# Altium schematic sheet sheet.SchDoc
size A3
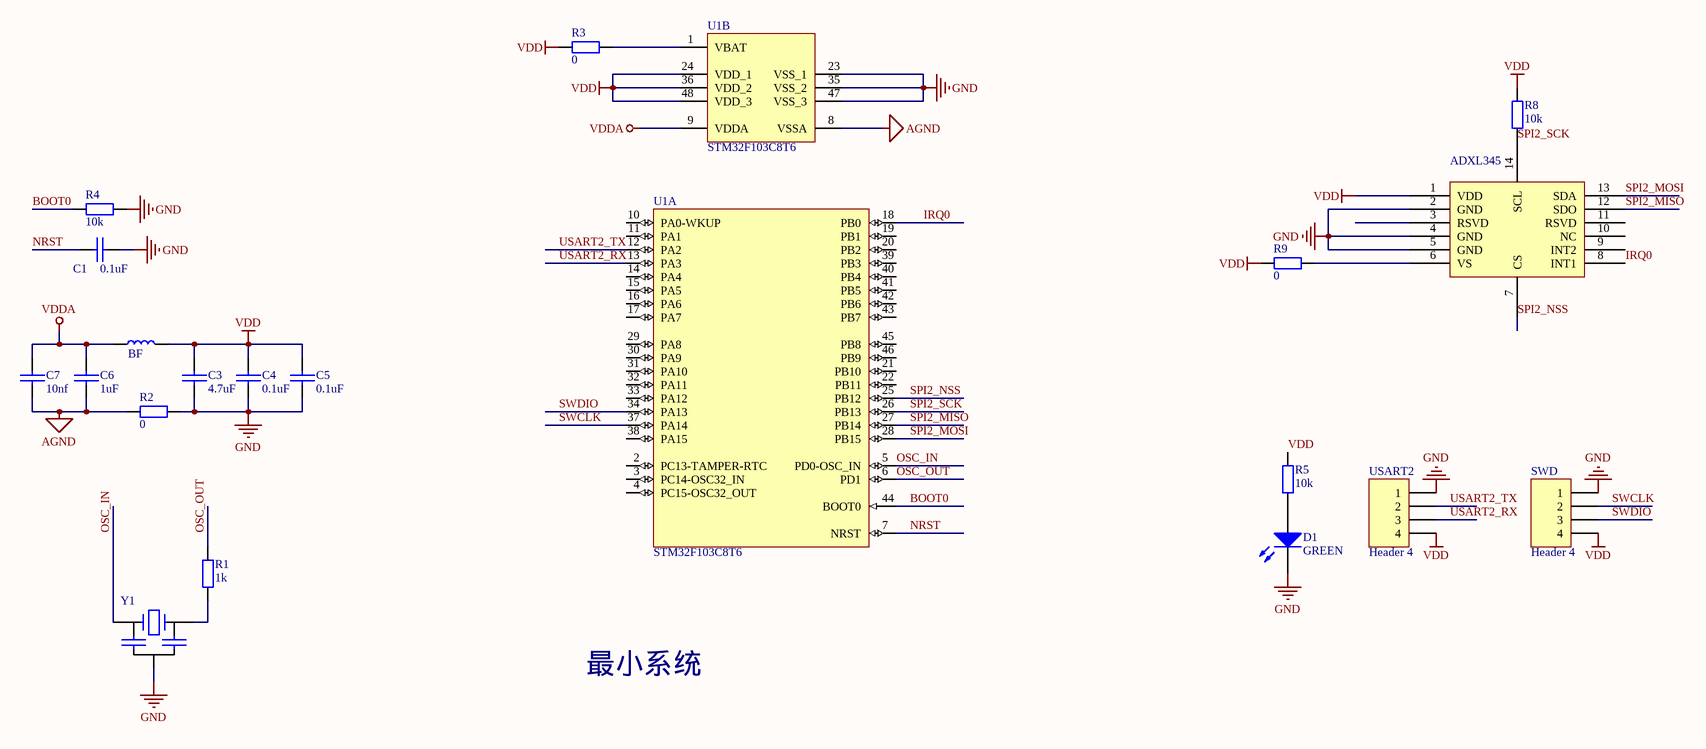
[diagram p0: sheet.SchDoc]

## Parts
ADXL345  ADXL345  [ADXL345]  (value not drawn)
BF  BF  [R1608[0603]]  (value not drawn)
C1  value 0.1uF  [C1608[0603]N]  (hidden comment: cap smd)
C3  value 4.7uF  [C1608[0603]N]  (hidden comment: cap smd)
C4  value 0.1uF  [C1608[0603]N]  (hidden comment: cap smd)
C5  value 0.1uF  [C1608[0603]N]  (hidden comment: cap smd)
C6  value 1uF  [C1608[0603]N]  (hidden comment: cap smd)
C7  value 10nf  [C1608[0603]N]  (hidden comment: cap smd)
D1  value GREEN  [D1608[0603]]  (hidden comment: LED)
R1  value 1k  [R1608[0603]]  (hidden comment: RES1)
R2  value 0  [R1608[0603]]  (hidden comment: RES1)
R3  value 0  [1608[0603]]  (hidden comment: RES1)
R4  value 10k  [R1608[0603]]  (hidden comment: RES1)
R5  value 10k  [R1608[0603]]  (hidden comment: RES1)
R8  value 10k  [R1608[0603]]  (hidden comment: RES1)
R9  value 0  [R1608[0603]]  (hidden comment: RES1)
SWD  Header 4  [HDR1X4]
U1  STM32F103C8T6  [LQFP48_N]  (parts A,B of 2)
USART2  Header 4  [HDR1X4]
Y1  CSTCE8M00G52  [Crystal_C]  (value not drawn)

## Nets
AGND: C6.2 C7.2 R2.1 U1.8(VSSA)
GND: ADXL345.2(GND) ADXL345.4(GND) ADXL345.5(GND) C1.1 C3.2 C4.2 C5.2 D1.2(K) R2.2 R4.1 SWD.1 U1.23(VSS_1) U1.35(VSS_2) U1.47(VSS_3) USART2.1 Y1.2(GND)
VDD: ADXL345.1(VDD) BF.2 C3.1 C4.1 C5.1 R3.1 R5.2 R8.2 R9.1 SWD.4 U1.24(VDD_1) U1.36(VDD_2) U1.48(VDD_3) USART2.4
VDDA: BF.1 C6.1 C7.1 U1.9(VDDA)
BOOT0: R4.2 U1.44(BOOT0)
IRQ0: ADXL345.8(INT1) U1.18(PB0)
NRST: C1.2 U1.7(NRST)
OSC_IN: U1.5(PD0-OSC_IN) Y1.1
OSC_OUT: R1.2 U1.6(PD1)
SPI2_MISO: ADXL345.12(SDO) U1.27(PB14)
SPI2_MOSI: ADXL345.13(SDA) U1.28(PB15)
SPI2_NSS: ADXL345.7(CS) U1.25(PB12)
SPI2_SCK: ADXL345.14(SCL) R8.1 U1.26(PB13)
SWCLK: SWD.2 U1.37(PA14)
SWDIO: SWD.3 U1.34(PA13)
USART2_RX: U1.13(PA3) USART2.3
USART2_TX: U1.12(PA2) USART2.2
NetADXL345_6: ADXL345.6(VS) R9.2
NetD1_1: D1.1(A) R5.1
NetR1_1: R1.1 Y1.3
NetR3_2: R3.2 U1.1(VBAT)

Not connected (* = marked no-connect by the designer): ADXL345 3(RSVD) 9(INT2) 10(NC) 11(RSVD); U1 2(PC13-TAMPER-RTC) 3(PC14-OSC32_IN) 4(PC15-OSC32_OUT) 10(PA0-WKUP) 11(PA1) 14(PA4) 15(PA5) 16(PA6) 17(PA7) 19(PB1) 20(PB2) 21(PB10) 22(PB11) 29(PA8) 30(PA9) 31(PA10) 32(PA11) 33(PA12) 38(PA15) 39(PB3) 40(PB4) 41(PB5) 42(PB6) 43(PB7) 45(PB8) 46(PB9)

## Notes on the sheet
- 最小系统

## Library data of the parts
BF = BF: 磁珠
C1 C3-C7 = CAP: 贴片无极性电容
D1 = LED: 蓝色 LED; Published: 8-Jun-2000; LatestRevisionDate: 08-Jul-2005; LatestRevisionNote: Mech Layer 1 removed.; Publisher: Altium Limited
SWD USART2 = Header 4: Header, 4-Pin; LatestRevisionDate: 17-Jul-2002; LatestRevisionNote: Re-released for DXP Platform.; Publisher: Altium Limited
U1 = STM32F103C8T6: STM32 ARM-based 32-bit MCU Performance Line with 64 kB Flash, 20 kB Internal RAM, -40 to +85癈 Temperature, 48-Pin LQFP, Tray; DatasheetVersion: rev13.0, Apr-2011; PackageVersion: rev13, Apr-2011; PackageReference: LQFP48; PackageDescription: 48-Pin Low-Profile Quad Flat Pack, 7 x 7 mm Body, 0.5 mm Pitch (LQFP48); ComponentLink1Description: Manufacturer URL; ComponentLink1URL: http://www.st.com/; ComponentLink2Description: STM32F103 Datasheet; ComponentLink2URL: http://www.st.com/internet/com/TECHNICAL_RESOURCES/TECHNICAL_LITERATURE/DATASHEET/CD00161566.pdf; ComponentLink3Description: STM32 Family Web Page; ComponentLink3URL: www.st.com/stm32
Y1 = CRYSTAL_C: Crystal_8M